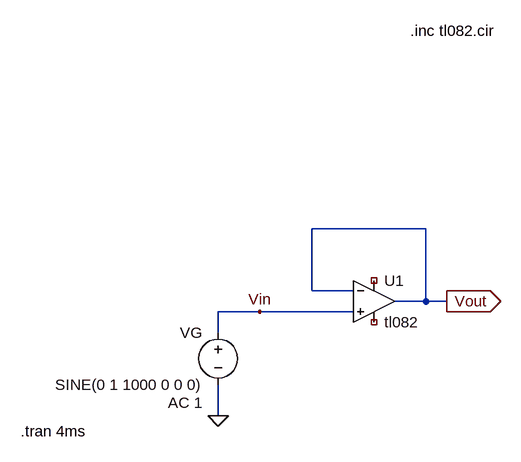
[diagram p0: schematic UnityGain.asc]
UnityGain.asc, the LTspice schematic file:
Version 4
SHEET 1 948 680
WIRE 256 64 80 64
WIRE 80 160 80 64
WIRE 144 160 80 160
WIRE 256 176 256 64
WIRE 256 176 208 176
WIRE 288 176 256 176
WIRE 0 192 -64 192
WIRE 144 192 0 192
WIRE -64 224 -64 192
WIRE -64 352 -64 304
FLAG -64 352 0
FLAG 0 192 Vin
FLAG 288 176 Vout
IOPIN 288 176 Out
SYMBOL voltage -64 208 M0
WINDOW 123 24 124 Left 2
WINDOW 39 0 0 Left 2
SYMATTR Value2 AC 1
SYMATTR InstName VG
SYMATTR Value SINE(0 1 1000 0 0 0)
SYMBOL Opamps\\opamp2 176 112 R0
SYMATTR InstName U1
SYMATTR Value tl082
TEXT 232 -240 Left 2 !.inc tl082.cir
TEXT -368 376 Left 2 !.tran 4ms

The netlist it stands for:
* UnityGain.asc
VG Vin 0 SINE(0 1 1000 0 0 0) AC 1
XU1 Vin Vout NC_01 NC_02 Vout tl082  ; pins In+ In- V+ V- OUT
.inc tl082.cir
.tran 4ms
.backanno
.end

* Results of the author's LTspice run, read from the files saved beside the schematic
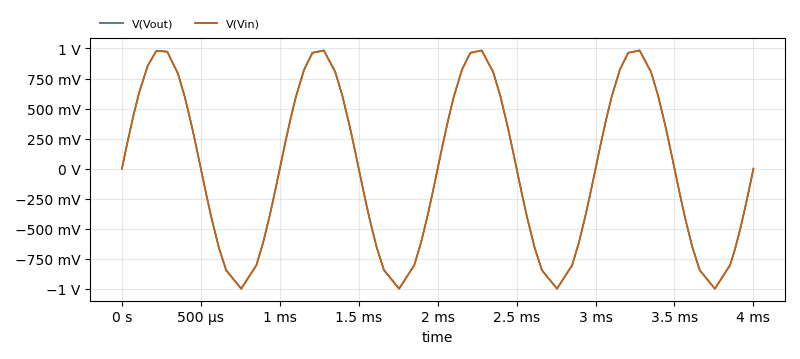
[diagram p1: Transient Analysis of UnityGain.asc, plotted from the saved traces]
* Transient Analysis, 1 run:
*   V(Vout): min -997.2 mV, max 984.3 mV, average 3.984 mV, rms 698.4 mV, last 990.8 µV
*   V(Vin): min -998.4 mV, max 982.9 mV, average 2.703 mV, rms 698.4 mV, last 0 V